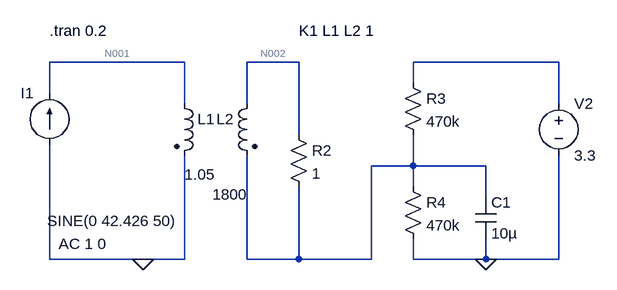
[diagram p0: schematic FYP CT.asc]
FYP CT.asc, the LTspice schematic file:
Version 4
SHEET 1 880 680
WIRE 16 -16 -192 -16
WIRE 192 -16 112 -16
WIRE 592 -16 368 -16
WIRE 368 16 368 -16
WIRE -192 32 -192 -16
WIRE 16 48 16 -16
WIRE 112 48 112 -16
WIRE 592 48 592 -16
WIRE 192 96 192 -16
WIRE 368 144 368 96
WIRE 368 144 304 144
WIRE 480 144 368 144
WIRE 368 176 368 144
WIRE 480 192 480 144
WIRE -192 288 -192 112
WIRE -48 288 -192 288
WIRE 16 288 16 128
WIRE 16 288 -48 288
WIRE 112 288 112 128
WIRE 192 288 192 176
WIRE 192 288 112 288
WIRE 304 288 304 144
WIRE 304 288 192 288
WIRE 368 288 368 256
WIRE 480 288 480 256
WIRE 480 288 368 288
WIRE 592 288 592 128
WIRE 592 288 480 288
FLAG 480 288 0
FLAG -48 288 0
SYMBOL res 176 80 R0
SYMATTR InstName R2
SYMATTR Value 1
SYMBOL res 352 0 R0
SYMATTR InstName R3
SYMATTR Value 470k
SYMBOL res 352 160 R0
SYMATTR InstName R4
SYMATTR Value 470k
SYMBOL cap 464 192 R0
SYMATTR InstName C1
SYMATTR Value 10µ
SYMBOL voltage 592 32 R0
WINDOW 123 0 0 Left 2
WINDOW 39 0 0 Left 2
SYMATTR InstName V2
SYMATTR Value 3.3
SYMBOL ind2 0 32 R0
WINDOW 3 16 125 Left 2
SYMATTR Value 1.05
SYMATTR InstName L1
SYMATTR Type ind
SYMBOL ind2 128 32 M0
WINDOW 3 15 156 Left 2
SYMATTR Value 1800
SYMATTR InstName L2
SYMATTR Type ind
SYMBOL current -192 112 R180
WINDOW 0 24 80 Left 2
WINDOW 3 -197 -117 Left 2
WINDOW 123 -88 -152 Left 2
WINDOW 39 0 0 Left 2
SYMATTR InstName I1
SYMATTR Value SINE(0 42.426 50)
SYMATTR Value2 AC 1 0
TEXT -192 -64 Left 2 !.tran 0.2
TEXT 192 -64 Left 2 !K1 L1 L2 1

The netlist it stands for:
* FYP CT.asc
R2 N002 N004 1
R3 N003 N004 470k
R4 N004 0 470k
C1 N004 0 10µ
V2 N003 0 3.3
L1 N001 0 1.05
L2 N002 N004 1800
I1 0 N001 SINE(0 42.426 50) AC 1 0
.tran 0.2
K1 L1 L2 1
.backanno
.end

* Results of the author's LTspice run, read from the files saved beside the schematic
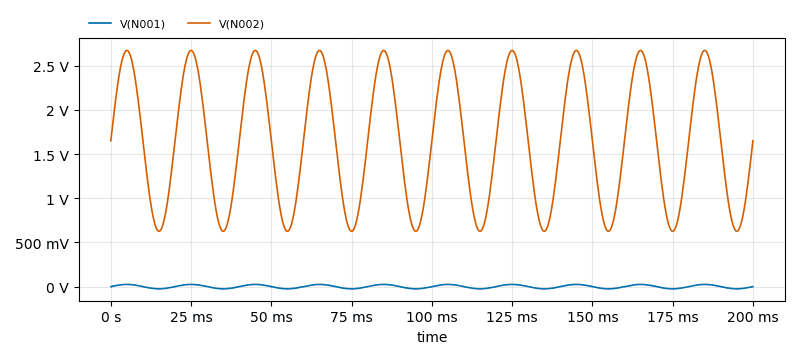
[diagram p1: Transient Analysis of FYP CT.asc, plotted from the saved traces]
* Transient Analysis, 1 run:
*   V(N001): min -24.73 mV, max 24.73 mV, average -2.794 µV, rms 17.49 mV, last 27.99 µV
*   V(N002): min 626.3 mV, max 2.674 V, average 1.65 V, rms 1.802 V, last 1.65 V